# Altium schematic sheet rs485_interface.SchDoc: MODBUS Over Isolated RS-485 Demo
size Letter; Organization: ORGANIZATION; Address1: ADDRESS 1; Address2: ADDRESS 2; Address3: ADDRESS 3; Address4: ADDRESS 4; Revision: -; SheetNumber: 2; SheetTotal: 2; ENG_APP_DATE: --/--/--; DSN_APP_DATE: --/--/--; CHK_APP_DATE: --/--/--
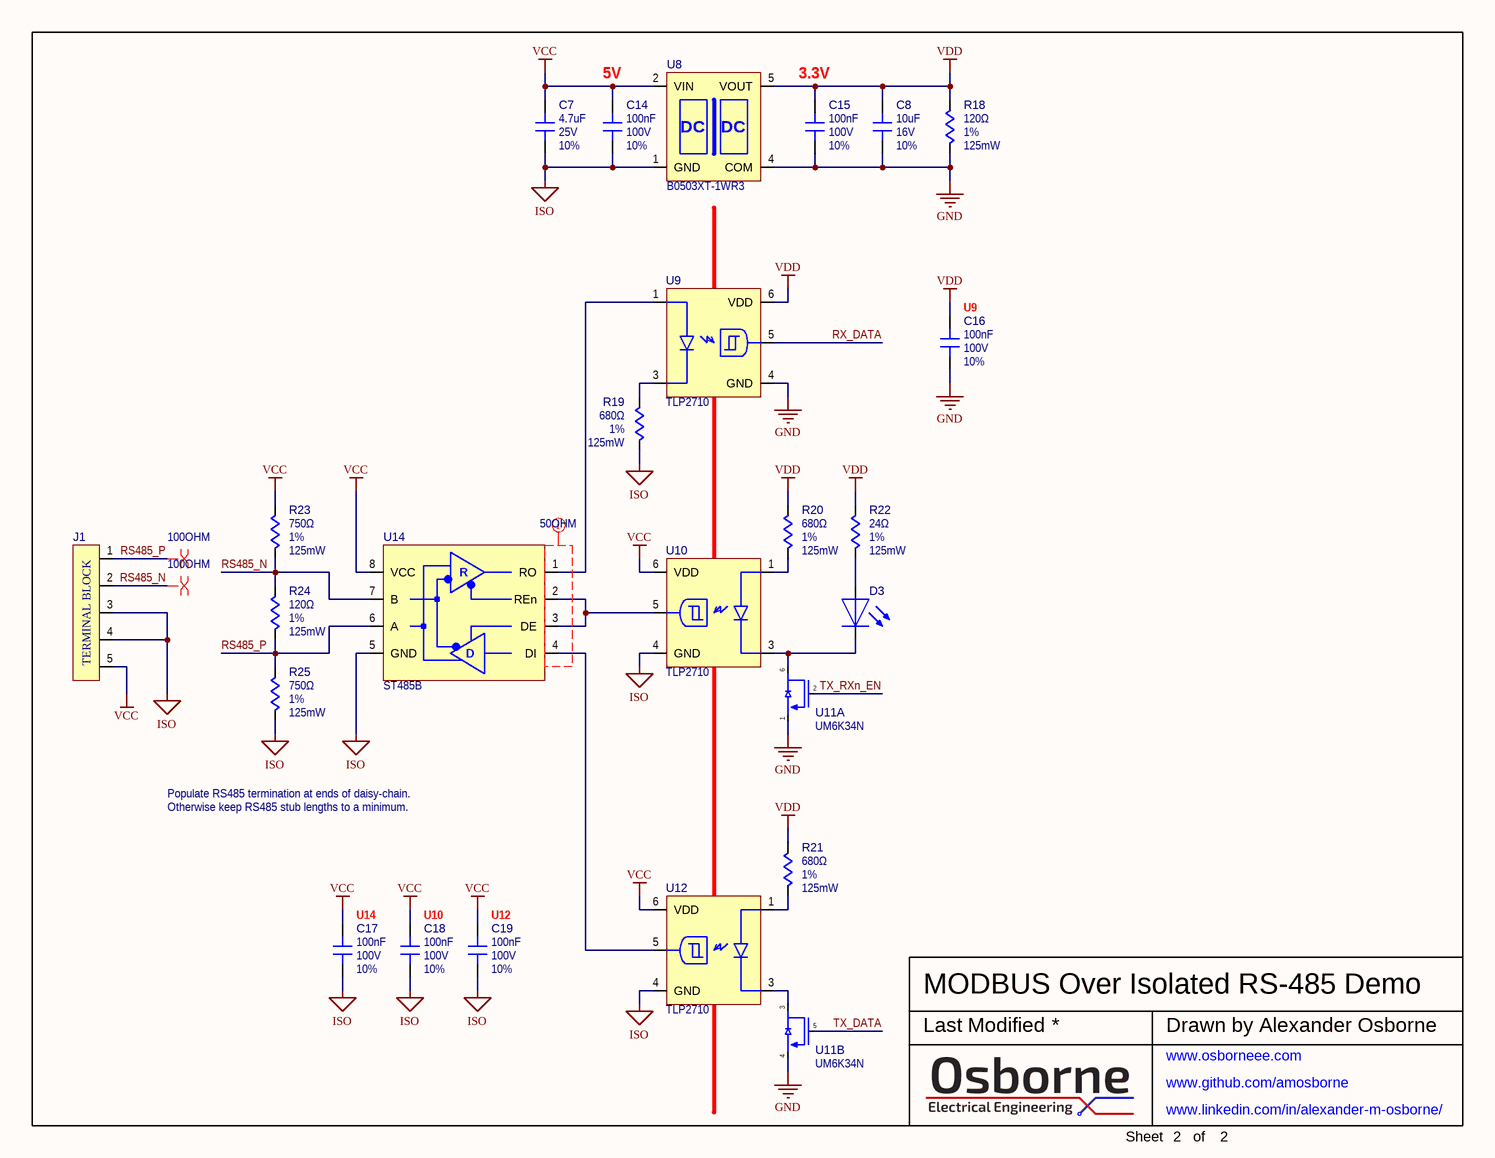
[diagram p0: rs485_interface.SchDoc]

## Parts
C7  value 4.7uF  Voltage: 25V  Tolerance: 10%  [C0805]  (hidden comment: CAP-CER-4U70-10T-25V-0805)
C8  value 10uF  Voltage: 16V  Tolerance: 10%  [C0805]  (hidden comment: CAP-CER-10U0-10T-16V-0805)
C14  value 100nF  Voltage: 100V  Tolerance: 10%  [C0805]  (hidden comment: CAP-CER-100N-10T-100V-0805)
C15  value 100nF  Voltage: 100V  Tolerance: 10%  [C0805]  (hidden comment: CAP-CER-100N-10T-100V-0805)
C16  value 100nF  Voltage: 100V  Tolerance: 10%  [C0805]  (hidden comment: CAP-CER-100N-10T-100V-0805)
C17  value 100nF  Voltage: 100V  Tolerance: 10%  [C0805]  (hidden comment: CAP-CER-100N-10T-100V-0805)
C18  value 100nF  Voltage: 100V  Tolerance: 10%  [C0805]  (hidden comment: CAP-CER-100N-10T-100V-0805)
C19  value 100nF  Voltage: 100V  Tolerance: 10%  [C0805]  (hidden comment: CAP-CER-100N-10T-100V-0805)
D3  LED_BLUE  [D0805]  (value not drawn)
J1  TBLOCK_5POS  [TBLOCK_5POS]  (value not drawn)
R18  value 120Ω  Tolerance: 1%  Power: 125mW  [R0805]  (hidden comment: RES-120R-1T00-W125-0805)
R19  value 680Ω  Tolerance: 1%  Power: 125mW  [R0805]  (hidden comment: RES-680R-1T00-W125-0805)
R20  value 680Ω  Tolerance: 1%  Power: 125mW  [R0805]  (hidden comment: RES-680R-1T00-W125-0805)
R21  value 680Ω  Tolerance: 1%  Power: 125mW  [R0805]  (hidden comment: RES-680R-1T00-W125-0805)
R22  value 24Ω  Tolerance: 1%  Power: 125mW  [R0805]  (hidden comment: RES-24R0-1T00-W125-0805)
R23  value 750Ω  Tolerance: 1%  Power: 125mW  [R0805]  (hidden comment: RES-750R-1T00-W125-0805)
R24  value 120Ω  Tolerance: 1%  Power: 125mW  [R0805]  (hidden comment: RES-120R-1T00-W125-0805)
R25  value 750Ω  Tolerance: 1%  Power: 125mW  [R0805]  (hidden comment: RES-750R-1T00-W125-0805)
U8  B0503XT-1WR3  [B05_XT-1WR3]
U9  TLP2710  [TLP2710_SO-6L]
U10  TLP2710  [TLP2710_SO-6L]
U11  UM6K34N  [UM6K34N_SC-88]  (parts A,B of 2)
U12  TLP2710  [TLP2710_SO-6L]
U14  ST485B  [ST485B_SO-8]

## Nets
GND: C8.2 C15.2 C16.2 R18.2 U8.4(COM) U9.4(GND) U11.1(S1) U11.4(S2)
ISO: C7.2 C14.2 C17.2 C18.2 C19.2 J1.3 J1.4 R19.2 R25.2 U8.1(GND) U10.4(GND) U12.4(GND) U14.5(GND)
VCC: C7.1 C14.1 C17.1 C18.1 C19.1 J1.5 R23.1 U8.2(VIN) U10.6(VDD) U12.6(VDD) U14.8(VCC)
VDD: C8.1 C15.1 C16.1 R18.1 R20.1 R21.1 R22.1 U8.5(VOUT) U9.6(VDD)
RS485_N: J1.2 R23.2 R24.1 U14.7(B)
RS485_P: J1.1 R24.2 R25.1 U14.6(A)
RX_DATA: U9.5(VO)
TX_DATA: U11.5(G2)
TX_RXn_EN: U11.2(G1)
NetD3_1: D3.1 U10.3(CATHODE) U11.6(D1)
NetD3_2: D3.2 R22.2
NetR19_1: R19.1 U9.3(CATHODE)
NetR20_2: R20.2 U10.1(ANODE)
NetR21_2: R21.2 U12.1(ANODE)
NetU9_1: U9.1(ANODE) U14.1(RO)
NetU10_5: U10.5(VO) U14.2(REn) U14.3(DE)
NetU11_3: U11.3(D2) U12.3(CATHODE)
NetU12_5: U12.5(VO) U14.4(DI)

Not connected (* = marked no-connect by the designer): U8 8(NC); U9 2(NC); U10 2(NC); U12 2(NC)

## Layout directives
differential pair; differential pair class 100OHM: RS485_N, RS485_P
net class 50OHM: (no net found under the mark)

## Notes on the sheet
- 5V
- 3.3V
- (near C16) U9
- Populate RS485 termination at ends of daisy-chain.
- Otherwise keep RS485 stub lengths to a minimum.
- (near C17) U14
- (near C18) U10
- (near C19) U12
- Last Modified
- Drawn by Alexander Osborne
- www.osborneee.com <http://www.osborneee.com>
- www.github.com/amosborne <http://www.github.com/amosborne>
- Sheet
- www.linkedin.com/in/alexander-m-osborne/ <http://www.linkedin.com/in/alexander-m-osborne/>
- of
- (in symbol B0503XT-1WR3) DC
- (in symbol ST485B) R; D
- (in symbol TBLOCK_5POS) TERMINAL BLOCK

## Library data of the parts
C7 = CAP-CER-4U70-10T-25V-0805: CAP, CER, 4.7uF ±10%, 25V, 0805; Supplier 1: Digi-Key; Supplier Part Number 1: 1276-2969-1-ND
C8 = CAP-CER-10U0-10T-16V-0805: CAP, CER, 10uF ±10%, 16V, 0805; Supplier 1: Digi-Key; Supplier Part Number 1: 1276-2872-1-ND
C14-C19 = CAP-CER-100N-10T-100V-0805: CAP, CER, 100nF ±10%, 100V, 0805; Supplier 1: Digi-Key; Supplier Part Number 1: 732-12244-1-ND
D3 = LED_BLUE: Blue LED Indicator 0805; Supplier 1: Digi-Key; Supplier Part Number 1: 732-4982-1-ND
J1 = TBLOCK_5POS: Screw Terminal Block, 5-Position
R18 R24 = RES-120R-1T00-W125-0805: RES, 120Ω ±1.00%, 125mW, 0805; Supplier 1: Digi-Key; Supplier Part Number 1: A129738CT-ND
R19-R21 = RES-680R-1T00-W125-0805: RES, 680Ω ±1.00%, 125mW, 0805; Supplier 1: Digi-Key; Supplier Part Number 1: RMCF0805FT680RCT-ND
R22 = RES-24R0-1T00-W125-0805: RES, 24Ω ±1.00%, 125mW, 0805; Supplier 1: Digi-Key; Supplier Part Number 1: 541-24.0CCT-ND
R23 R25 = RES-750R-1T00-W125-0805: RES, 750Ω ±1.00%, 125mW, 0805; Supplier 1: Digi-Key; Supplier Part Number 1: 13-RT0805FRE07750RLCT-ND
U8 = B0503XT-1WR3: Isolated DC/DC, 5Vin, 3.3Vout, 300mA; Supplier 1: Digi-Key; Supplier Part Number 1: 2725-B0503XT-1WR3-ND
U9 U10 U12 = TLP2710: Logic Output Optoisolator 5MBd; Supplier 1: Digi-Key; Supplier Part Number 1: TLP2710(TP4ECT-ND
U11 = UM6K34N: NCH+NCH 50V 200mA Small Signal MOSFET; Supplier 1: Digi-Key; Supplier Part Number 1: UM6K34NTCNCT-ND
U14 = ST485B: 1/1 RS485 Transceiver, Half-Duplex; Supplier 1: Digi-Key; Supplier Part Number 1: 497-3733-1-ND